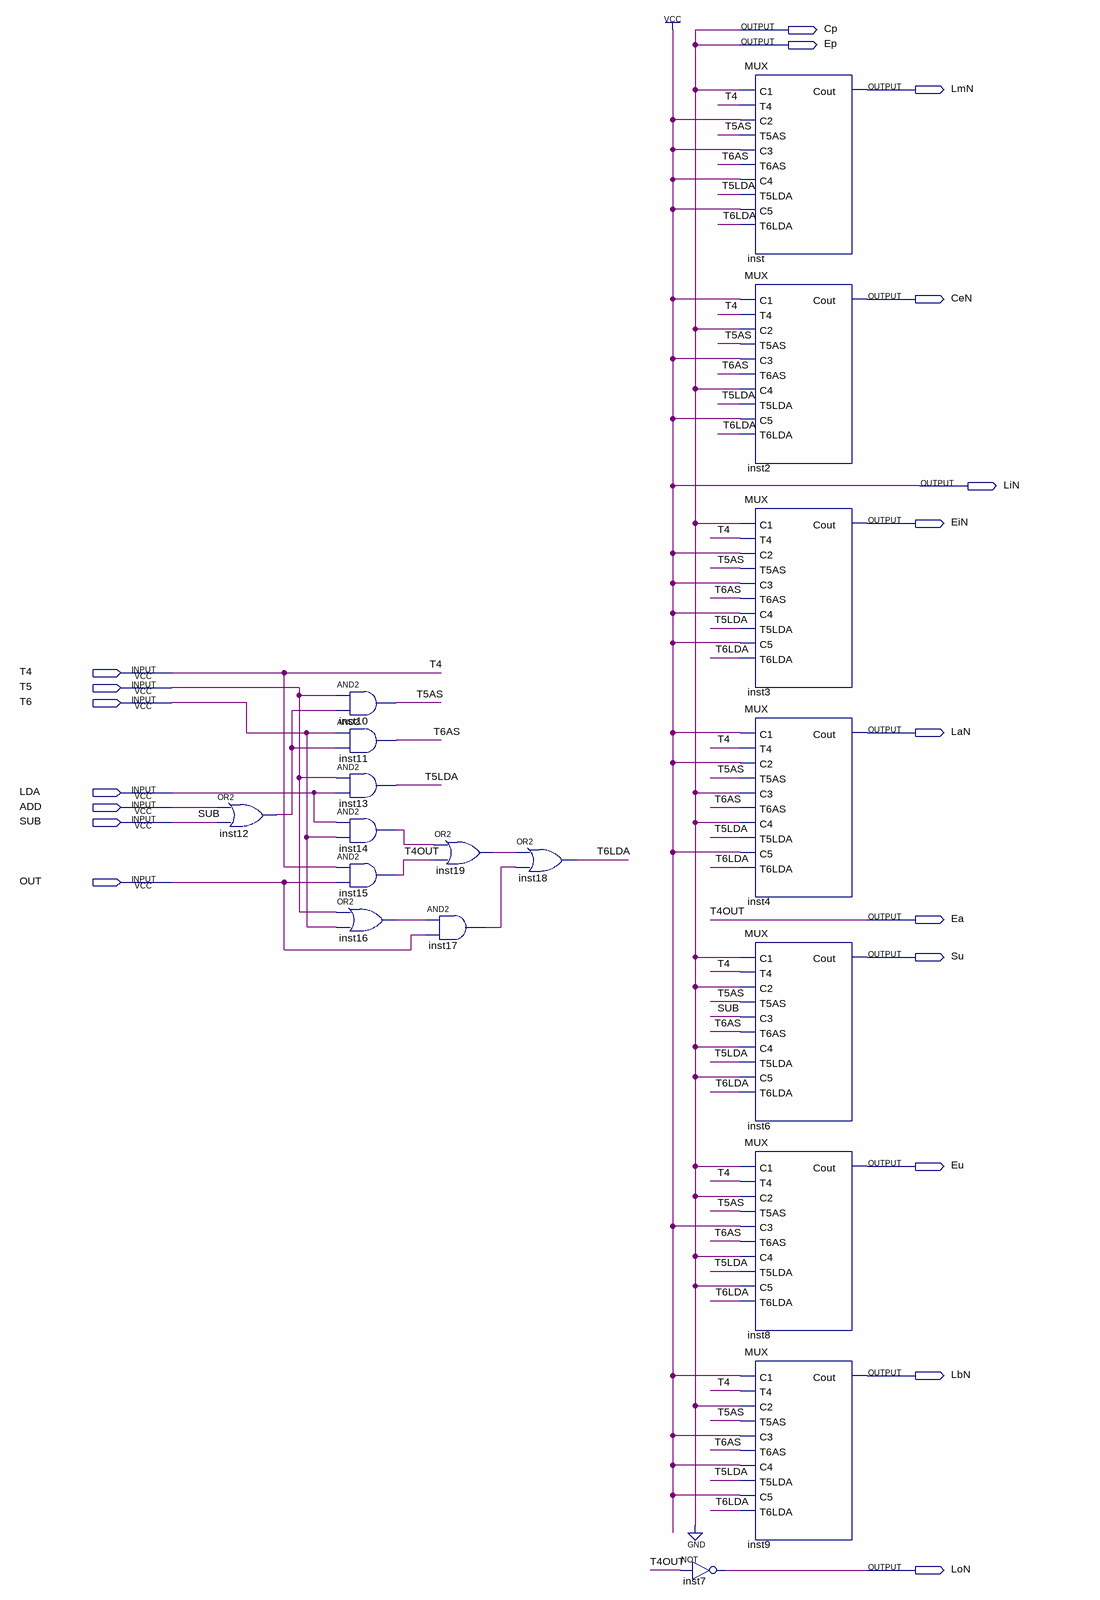
[diagram p0: schematic sheet]
// Quartus schematic CicloExecucao.bdf as structural Verilog: 18 symbols, 19 pins
module CicloExecucao (
  input  T4,
  input  T5,
  input  T6,
  input  LDA,
  input  ADD,
  input  SUB,
  input  OUT,
  output Cp,
  output Ep,
  output LmN,
  output CeN,
  output LiN,
  output EiN,
  output LaN,
  output Ea,
  output Su,
  output Eu,
  output LbN,
  output LoN
);

  wire inst12_out, inst14_out, inst16_out, inst17_out, inst19_out, T5AS, T5LDA, T6AS, T6LDA;

  or inst12 (inst12_out, ADD, SUB);
  and inst10 (T5AS, T5, inst12_out);
  and inst11 (T6AS, T6, inst12_out);
  and inst13 (T5LDA, T5, LDA);
  and inst14 (inst14_out, LDA, T6);
  and inst15 (Ea, T4, OUT);
  or inst16 (inst16_out, T5, T6);
  and inst17 (inst17_out, inst16_out, OUT);
  or inst19 (inst19_out, inst14_out, Ea);
  or inst18 (T6LDA, inst19_out, inst17_out);
  not inst7 (LoN, Ea);
  MUX inst (
    .C1(1'b0), .T4(T4), .C2(1'b1), .T5AS(T5AS), .C3(1'b1), .T6AS(T6AS), .C4(1'b1), .T5LDA(T5LDA), .C5(1'b1),
    .T6LDA(T6LDA), .Cout(LmN));
  MUX inst2 (
    .C1(1'b1), .T4(T4), .C2(1'b0), .T5AS(T5AS), .C3(1'b1), .T6AS(T6AS), .C4(1'b0), .T5LDA(T5LDA), .C5(1'b1),
    .T6LDA(T6LDA), .Cout(CeN));
  MUX inst3 (
    .C1(1'b0), .T4(T4), .C2(1'b1), .T5AS(T5AS), .C3(1'b1), .T6AS(T6AS), .C4(1'b1), .T5LDA(T5LDA), .C5(1'b1),
    .T6LDA(T6LDA), .Cout(EiN));
  MUX inst4 (
    .C1(1'b1), .T4(T4), .C2(1'b1), .T5AS(T5AS), .C3(1'b0), .T6AS(T6AS), .C4(1'b0), .T5LDA(T5LDA), .C5(1'b1),
    .T6LDA(T6LDA), .Cout(LaN));
  MUX inst6 (
    .C1(1'b0), .T4(T4), .C2(1'b0), .T5AS(T5AS), .C3(SUB), .T6AS(T6AS), .C4(1'b0), .T5LDA(T5LDA), .C5(1'b0),
    .T6LDA(T6LDA), .Cout(Su));
  MUX inst8 (
    .C1(1'b0), .T4(T4), .C2(1'b0), .T5AS(T5AS), .C3(1'b1), .T6AS(T6AS), .C4(1'b0), .T5LDA(T5LDA), .C5(1'b0),
    .T6LDA(T6LDA), .Cout(Eu));
  MUX inst9 (
    .C1(1'b1), .T4(T4), .C2(1'b0), .T5AS(T5AS), .C3(1'b1), .T6AS(T6AS), .C4(1'b1), .T5LDA(T5LDA), .C5(1'b1),
    .T6LDA(T6LDA), .Cout(LbN));

  assign Cp = 1'b0;
  assign Ep = 1'b0;
  assign LiN = 1'b1;

  // Other names for the same wires on the sheet: T4OUT = Ea
endmodule
